# EAGLE design mjholmes_RaspPiXBeeShield_v1 (EAGLE 6.2)
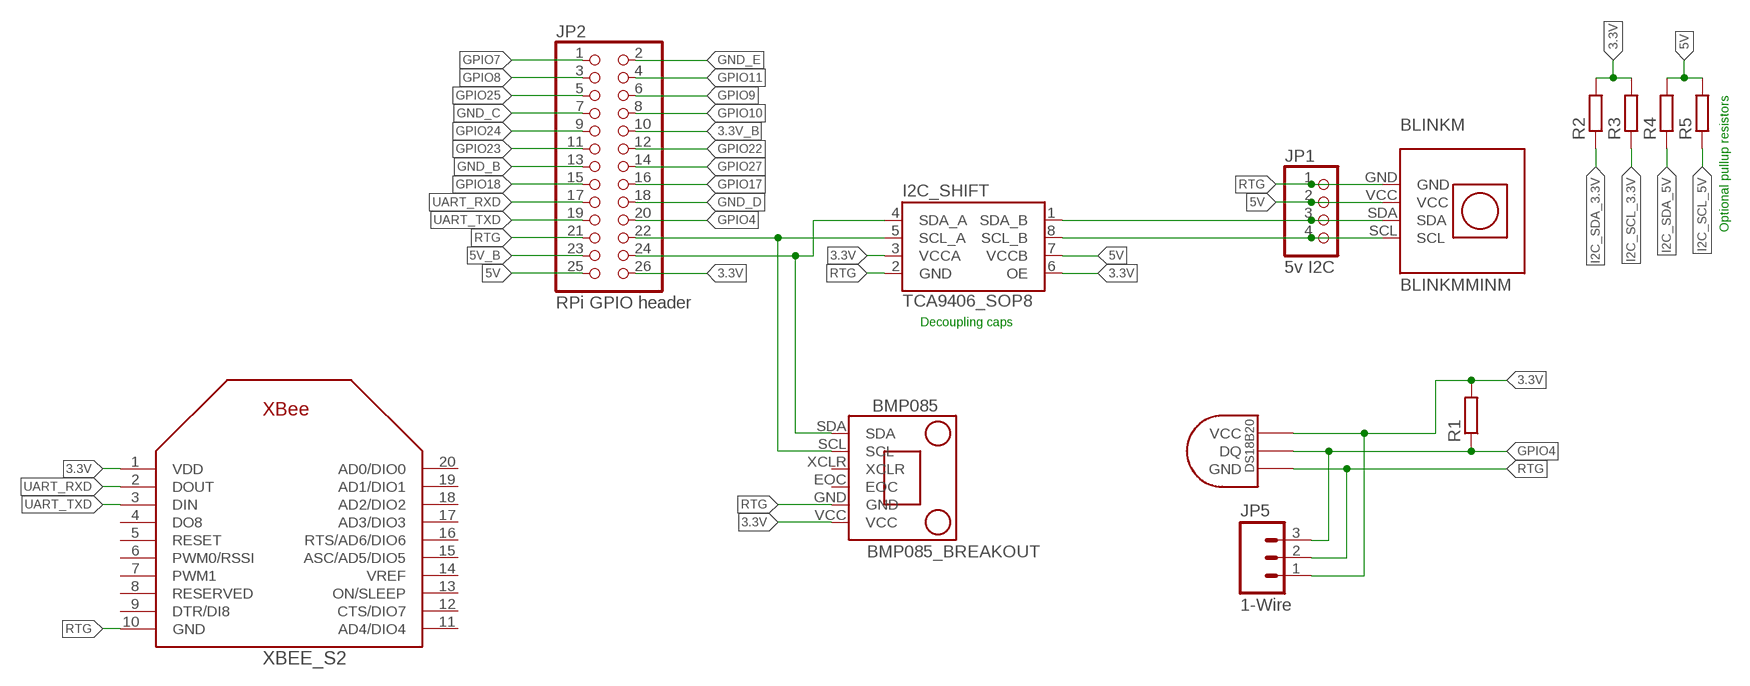
[diagram p0: schematic, sheet 1]

## Parts
BLINKM  BLINKMMINM  [BLINKM_MINM]
BMP085  BMP085_BREAKOUT  [BMP085_BREAKOUT]
I2C_SHIFT  TCA9406_SOP8  [SOP8]
JP1  5v I2C  PINHD-1X4  [1X04]
JP2  RPi GPIO header  PINHD-2X13  [2X13]
JP5  1-Wire  M03JST-PTH  [JST-3-PTH]
R1  R-EU_R0603  [R0603]
R2  R-EU_R0603  [R0603]
R3  R-EU_R0603  [R0603]
R4  R-EU_R0603  [R0603]
R5  R-EU_R0603  [R0603]
U$3  DS1820SOIC  [DS18B20_SOIC]
XBEE_S2  XBEE S2  XBEE_S2  [XBEE_S2]

## Nets
3.3V: BMP085.VCC I2C_SHIFT.3(VCCA) I2C_SHIFT.6(OE) JP2.26 JP5.1 R1.2 R2.2 R3.2 U$3.VCC XBEE_S2.1(VDD)
3.3V_B: JP2.10
5V: BLINKM.VCC I2C_SHIFT.7(VCCB) JP1.2 JP2.25 R4.2 R5.2
5V_B: JP2.23
GND_B: JP2.13
GND_C: JP2.7
GND_D: JP2.18
GND_E: JP2.2
GPIO4: JP2.20 JP5.3 R1.1 U$3.DQ
GPIO7: JP2.1
GPIO8: JP2.3
GPIO9: JP2.6
GPIO10: JP2.8
GPIO11: JP2.4
GPIO17: JP2.16
GPIO18: JP2.15
GPIO22: JP2.12
GPIO23: JP2.11
GPIO24: JP2.9
GPIO25: JP2.5
GPIO27: JP2.14
I2C_SCL_3.3V: BMP085.SCL I2C_SHIFT.5(SCL_A) JP2.22 R3.1
I2C_SCL_5V: BLINKM.SCL I2C_SHIFT.8(SCL_B) JP1.4 R5.1
I2C_SDA_3.3V: BMP085.SDA I2C_SHIFT.4(SDA_A) JP2.24 R2.1
I2C_SDA_5V: BLINKM.SDA I2C_SHIFT.1(SDA_B) JP1.3 R4.1
RTG: BLINKM.GND BMP085.GND I2C_SHIFT.2(GND) JP1.1 JP2.21 JP5.2 U$3.GND XBEE_S2.10(GND)
UART_RXD: JP2.17 XBEE_S2.2(DOUT)
UART_TXD: JP2.19 XBEE_S2.3(DIN)
Unconnected: BMP085.EOC BMP085.XCLR XBEE_S2.4(DO8) XBEE_S2.5(RESET) XBEE_S2.6(PWM0/RSSI) XBEE_S2.7(PWM1) XBEE_S2.8(RESERVED) XBEE_S2.9(DTR/DI8) XBEE_S2.11(AD4/DIO4) XBEE_S2.12(CTS/DIO7) XBEE_S2.13(ON/SLEEP) XBEE_S2.14(VREF) XBEE_S2.15(ASC/AD5/DIO5) XBEE_S2.16(RTS/AD6/DIO6) XBEE_S2.17(AD3/DIO3) XBEE_S2.18(AD2/DIO2) XBEE_S2.19(AD1/DIO1) XBEE_S2.20(AD0/DIO0)

## Notes on the sheet
- Optional pullup resistors
- Decoupling caps

## Library data of the parts
BLINKM = mjholmes:BLINKM
BMP085 = mjholmes:BMP085_BREAKOUT: This is a breakout board for the Bosch BMP085 high-precision, low-power barometric pressure sensor. Sparkfun SEN-11282
I2C_SHIFT = mjholmes:TCA9406
JP1 = pinhead:PINHD-1X4: PIN HEADER
JP2 = pinhead:PINHD-2X13: PIN HEADER
JP5 = SparkFun:M03: Header 3 Standard 3-pin 0.1" header. Use with straight break away headers (SKU : PRT-00116), right angle break away headers (PRT-00553), swiss pins (PRT-00743), machine pins (PRT-00117), and female headers (PRT-00115). Molex polarized connector foot print use with SKU : PRT-08232 with associated crimp pins and housings.
R1-R5 = resistor:R-EU_: RESISTOR, European symbol
U$3 = Ava:DS1820: DS18B20 Programmable Resolution 1-Wire Digital Thermometer Description The DS18B20 digital thermometer provides 9-bit to 12-bit Celsius temperature measurements and has an alarm function with nonvolatile user-programmable upper and lower trigger points. The DS18B20 communicates over a 1-Wire® bus that by definition requires only one data line (and ground) for communication with a central microprocessor. It has an operating temperature range of -55°C to +125°C and is accurate to ±0.5°C over the range of -10°C to +85°C. In addition, the DS18B20 can derive power directly from the data line ("parasite power"), eliminating the need for an external power supply. Each DS18B20 has a unique 64-bit serial code, which allows multiple DS18B20s to function on the same 1-Wire bus. Thus, it is simple to use one microprocessor to control many DS18B20s distributed over a large area. Applications that can benefit from this feature include HVAC environmental controls, temperature monitoring systems inside buildings, equipment, or machinery, and process monitoring and control systems.
XBEE_S2 = mjholmes:XBEE_S2

## Board
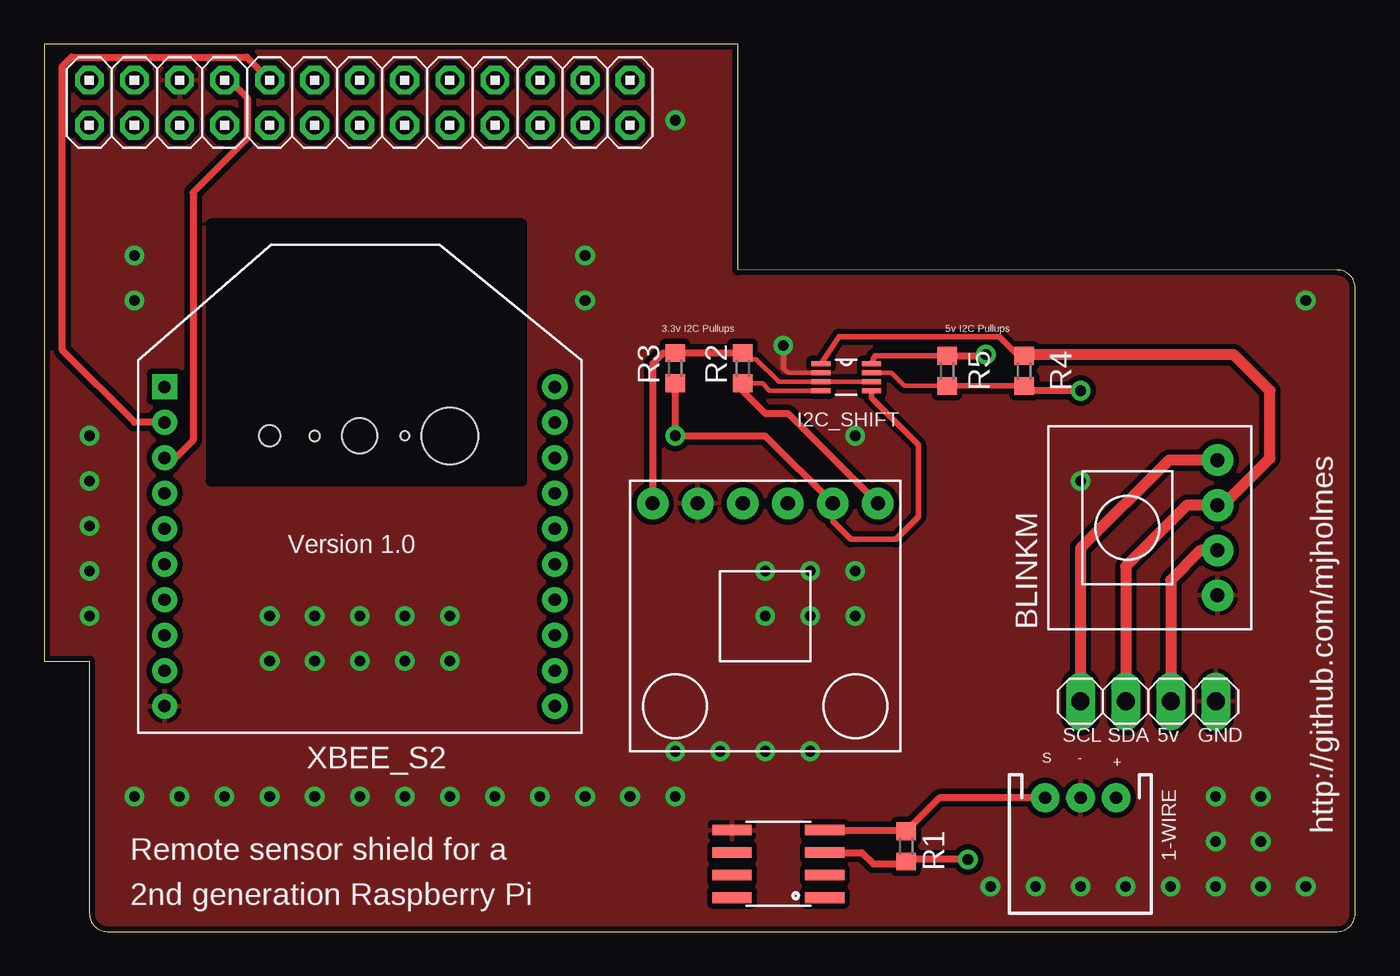
[diagram p1: board, top side]
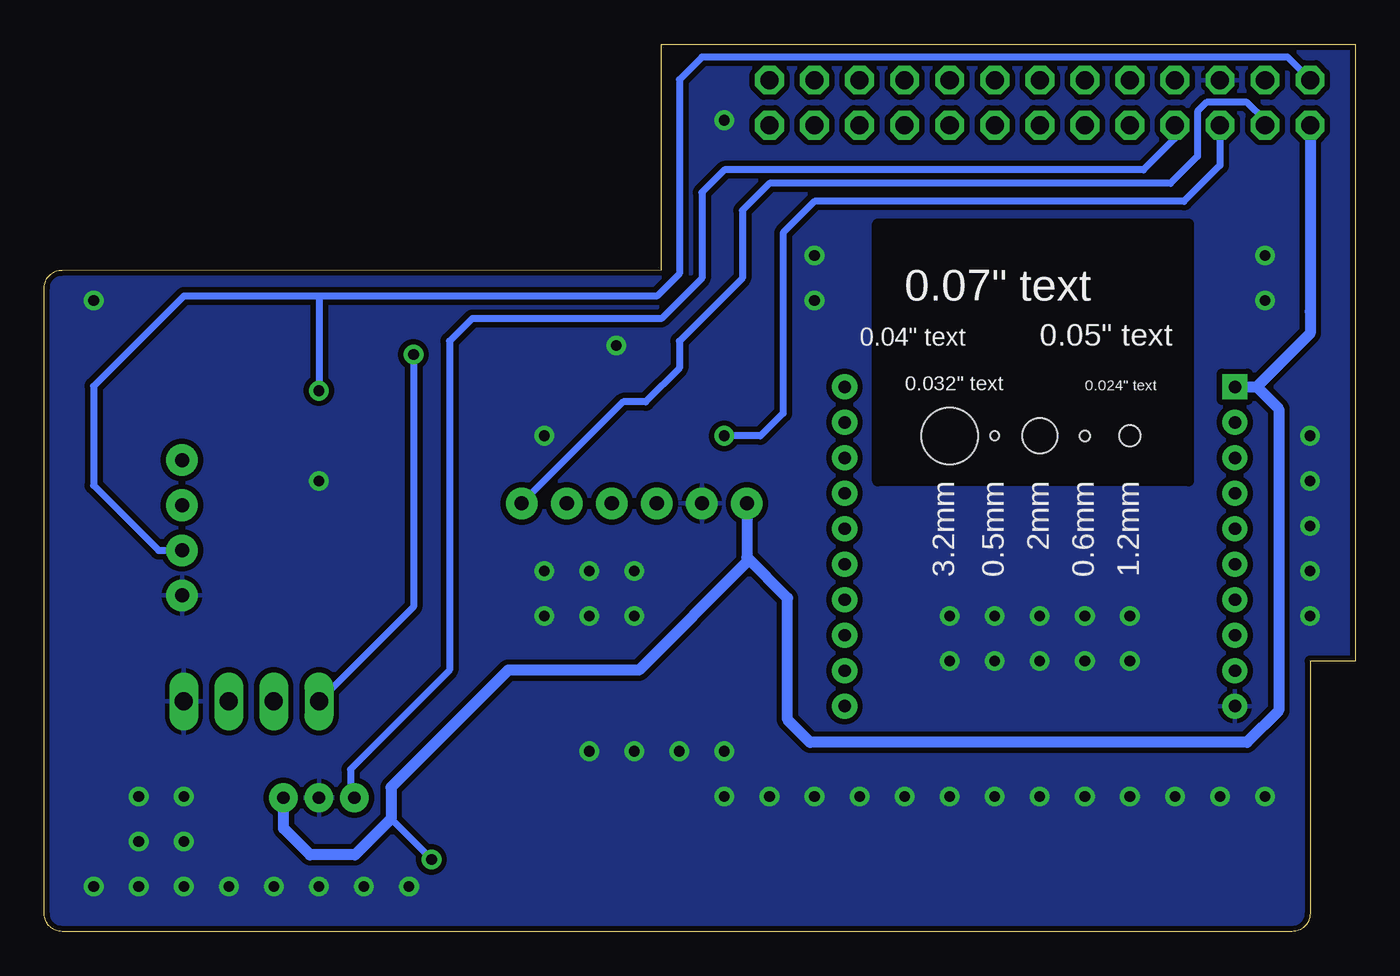
[diagram p2: board, bottom side, seen from below]

Size 73.9 x 50 mm. Coordinates in mm from the lower left corner, seen from the top.
Outline: 39.1,50 0,50 0,15.24 2.54,15.24 2.54,1 arc90 3.54,0 72.9,0 arc90 73.9,1 73.9,36.28 arc90 72.9,37.28 39.1,37.29 39.1,50
Copper layers (1*16): Top 0.035mm / dielectric 1.5mm / Bottom 0.035mm
Design rules: minimum track width 8mil, minimum drill 20mil, track to track 8mil, track to pad 8mil, pad to pad 8mil, via to via 8mil, smd to smd 8mil, copper to edge 10mil, drill to drill 8mil, minimum pad ring 12mil, minimum via ring 10mil, stop-mask expansion 4mil, vias tented up to drill 25mil, thermal gap 10mil
Holes 3.2 mm at 22.86,27.94
Holes 0.5 mm at 20.32,27.94
Holes 2 mm at 17.78,27.94
Holes 0.6 mm at 15.24,27.94
Holes 1.2 mm at 12.7,27.94
tRestrict: area 9.4,25.4 to 26.9,39.9
bRestrict: area 9.4,25.4 to 26.9,39.9

### Footprints (pad centres in the part's own frame; a part is rotated, then mirrored left to right if it is on the bottom)
BLINKM_MINM = drill 0.8 pad 1.778: GND -3.81,-3.81; SCL 3.81,-3.81; SDA 1.27,-3.81; VCC -1.27,-3.81
BMP085_BREAKOUT = drill 0.8 pad 1.778: EOC 8.89,1.27; GND 11.43,1.27; SCL 3.81,1.27; SDA 1.27,1.27; VCC 13.97,1.27; XCLR 6.35,1.27
SOP8 = smd 1.067 x 0.279: 1 -1.422,0.762; 2 -1.422,0.254; 3 -1.422,-0.254; 4 -1.422,-0.762; 5 1.422,-0.762; 6 1.422,-0.254; 7 1.422,0.254; 8 1.422,0.762
1X04 = drill 1.016 long: 1 -3.81,0; 2 -1.27,0; 3 1.27,0; 4 3.81,0
2X13 = drill 1.016 octagon: 1 -15.24,-1.27; 2 -15.24,1.27; 3 -12.7,-1.27; 4 -12.7,1.27; 5 -10.16,-1.27; 6 -10.16,1.27; 7 -7.62,-1.27; 8 -7.62,1.27; 9 -5.08,-1.27; 10 -5.08,1.27; 11 -2.54,-1.27; 12 -2.54,1.27; 13 0,-1.27; 14 0,1.27; 15 2.54,-1.27; 16 2.54,1.27; 17 5.08,-1.27; 18 5.08,1.27; 19 7.62,-1.27; 20 7.62,1.27; 21 10.16,-1.27; 22 10.16,1.27; 23 12.7,-1.27; 24 12.7,1.27; 25 15.24,-1.27; 26 15.24,1.27
JST-3-PTH = drill 0.7 pad 1.626: 1 -2,-5; 2 0,-5; 3 2,-5
R0603 = smd 1 x 1.1: 1 -0.85,0; 2 0.85,0
DS18B20_SOIC = smd 0.61 x 2.21: DQ 1.905,-2.616; GND 1.905,2.616; NC -1.905,-2.616; NC2 -0.635,-2.616; NC3 -1.905,2.616; NC4 -0.635,2.616; NC5 0.635,2.616; VCC 0.635,-2.616
XBEE_S2 = drill 0.7 pad 1.422 square: 1 -11,5.5 | drill 0.7 pad 1.422: 2 -11,3.5; 3 -11,1.5; 4 -11,-0.5; 5 -11,-2.5; 6 -11,-4.5; 7 -11,-6.5; 8 -11,-8.5; 9 -11,-10.5; 10 -11,-12.5; 11 11,-12.5; 12 11,-10.5; 13 11,-8.5; 14 11,-6.5; 15 11,-4.5; 16 11,-2.5; 17 11,-0.5; 18 11,1.5; 19 11,3.5; 20 11,5.5

### Placement (x,y rotation side)
BLINKM  62.33,22.76 90 top
BMP085  48.26,25.4 180 top
I2C_SHIFT  45.21,31.24 0 top
JP1  62.23,12.97 180 top
JP2  17.78,46.72 180 top
JP5  58.42,2.54 180 top
R1  48.58,4.8 270 top
R2  39.37,31.75 90 top
R3  35.56,31.75 90 top
R4  55.24,31.6 270 top
R5  50.89,31.6 270 top
U$3  41.38,3.82 90 top
XBEE_S2  17.78,25.2 0 top

### Tracks (layer width: path | path; a pad name or v marks a point on that pad's centre or on a via)
3.3V  (via drill 0.6)
  Top 0.254: I2C_SHIFT.6 I2C_SHIFT.3 41.41,30.98 40.13,32.26 39.71,32.26
  Top 0.305: 39.71,32.26 R2.2
  Top 0.406: R2.2 R3.2 34.89,32.6 34.29,32 BMP085.VCC | U$3.VCC 46.09,4.45 46.74,3.81 48.43,3.81 R1.2 48.69,4.06 v52.07,4.06
  Bottom 0.406: 54.36,6.35 v52.07,4.06
  Bottom 0.61: BMP085.VCC 34.29,21.08 | 34.29,21.08 34.29,20.83 40.39,14.73 47.75,14.73 48.01,14.48 54.36,8.13 54.36,6.35 56.39,4.32 58.93,4.32 60.42,5.81 JP5.1 | JP2.26 2.54,34.94 2.54,33.71 5.55,30.7 | XBEE_S2.1 5.55,30.7 | 5.55,30.7 4.32,29.46 4.32,12.45 6.1,10.67 30.73,10.67 32,11.94 32,18.8 34.29,21.08
5V  (via drill 0.6)
  Top 0.254: R5.2 48.5,30.75 47.75,31.5 46.61,31.5 I2C_SHIFT.7
  Top 0.305: R5.2 R4.2
  Top 0.406: v58.42,30.48 55.24,30.48 R4.2
  Top 0.61: BLINKM.VCC 65.17,21.49 63.5,19.81 JP1.2
  Bottom 0.406: JP2.25 2.54,48.01 3.81,49.28 36.83,49.28 38.1,48.01 38.1,37.08 39.37,35.81 58.42,35.81 | 58.42,35.81 66.04,35.81 71.12,30.73 71.12,25.15 67.46,21.49 BLINKM.VCC | 58.42,35.81 v58.42,30.48
GPIO4
  Top 0.406: U$3.DQ 48.51,5.72 R1.1 50.46,7.54 JP5.3
  Bottom 0.406: JP2.20 10.16,44.7 11.94,42.93 35.56,42.93 36.83,41.66 36.83,36.83 39.12,34.54 49.78,34.54 51.05,33.27 51.05,14.73 56.64,9.14 56.64,7.76 JP5.3
I2C_SCL_3.3V  (via drill 0.6)
  Top 0.305: I2C_SHIFT.5 46.63,30.07 47.24,29.46 49.28,27.43 49.28,23.37 48.01,22.1 45.47,22.1 44.45,23.11 BMP085.SCL
  Top 0.406: R3.1 v35.56,27.94 40.64,27.94 BMP085.SCL
  Bottom 0.406: JP2.22 7.62,43.18 9.65,41.15 30.48,41.15 32.26,39.37 32.26,29.21 33.53,27.94 v35.56,27.94
I2C_SCL_5V  (via drill 0.6)
  Top 0.305: I2C_SHIFT.8 46.83,32.45 R5.1
  Top 0.406: R5.1 53.02,32.45 v53.09,32.51
  Top 0.61: BLINKM.SCL 63.4,26.57 58.42,21.59 JP1.4
  Bottom 0.406: v53.09,32.51 53.09,18.3 JP1.4
I2C_SDA_3.3V
  Top 0.254: I2C_SHIFT.4 40.89,30.48 40.47,30.9 R2.1
  Top 0.406: R2.1 39.37,30.48 40.64,29.21 41.91,29.21 BMP085.SDA
  Bottom 0.406: JP2.24 5.08,45.72 6.1,46.74 8.38,46.74 8.89,46.23 8.89,43.69 10.41,42.16 33.02,42.16 34.54,40.64 34.54,36.83 38.1,33.27 38.1,31.75 40.01,29.84 41.27,29.84 BMP085.SDA
I2C_SDA_5V
  Top 0.305: I2C_SHIFT.1 44.8,33.53 53.85,33.53 54.93,32.45 R4.1
  Top 0.61: R4.1 55.3,32.51 67.06,32.51 69.09,30.48 69.09,26.67 66.44,24.03 BLINKM.SDA 64.41,24.03 60.96,20.57 JP1.3
RTG  (via drill 0.6)
  Top 0.254: 41.66,31.75 41.91,31.5 43,31.5 I2C_SHIFT.2
  Top 0.305: 41.66,31.75 v41.66,33.02
  other vias: 7.62,7.62 17.78,7.62 27.94,7.62 43.18,17.78 40.64,20.32 58.42,25.4 71.12,35.56 5.08,35.56 35.56,45.72 71.12,2.54 68.58,2.54 66.04,2.54 63.5,2.54 60.96,2.54 58.42,2.54 55.88,2.54 53.34,2.54 30.48,7.62 33.02,7.62 35.56,7.62 35.56,10.16 38.1,10.16 40.64,10.16 43.18,10.16 20.32,7.62 22.86,7.62 25.4,7.62 15.24,7.62 12.7,7.62 10.16,7.62 5.08,7.62 5.08,38.1 2.54,27.94 2.54,25.4 2.54,22.86 2.54,20.32 2.54,17.78 30.48,35.56 30.48,38.1 43.18,20.32 40.64,17.78 45.72,20.32 45.72,17.78 66.04,5.08 68.58,5.08 68.58,7.62 66.04,7.62 45.72,27.94 12.7,15.24 15.24,15.24 17.78,15.24 20.32,15.24 22.86,15.24 22.86,17.78 20.32,17.78 17.78,17.78 15.24,17.78 12.7,17.78
  pour Top (isolate 0.305): 0,50 39.5,50 39.5,37.5 74,37.5 74,0 0,0
  pour Bottom (isolate 0.305): 0,50 39.5,50 39.5,37.5 74,37.5 74,0 0,0
UART_RXD
  Top 0.406: XBEE_S2.2 5.08,28.7 1.02,32.77 1.02,48.77 1.52,49.28 11.41,49.28 JP2.17
UART_TXD
  Top 0.406: JP2.19 10.43,47.99 11.43,46.99 11.43,44.7 8.89,42.16 8.38,41.66 8.38,27.69 7.4,26.7 XBEE_S2.3

### Text on the board
tPlace: 3.3v I2C Pullups | 5v I2C Pullups | Version 1.0 | SCL | SDA | 5v | GND | S | - | + | 1-WIRE | http://github.com/mjholmes | Remote sensor shield for a | 2nd generation Raspberry Pi
bPlace: 0.07" text | 0.05" text | 0.04" text | 0.024" text | 0.032" text | 1.2mm | 0.6mm | 2mm | 0.5mm | 3.2mm